# Altium schematic sheet 0_overview.SchDoc
size A; SheetNumber: 1; SheetTotal: 5
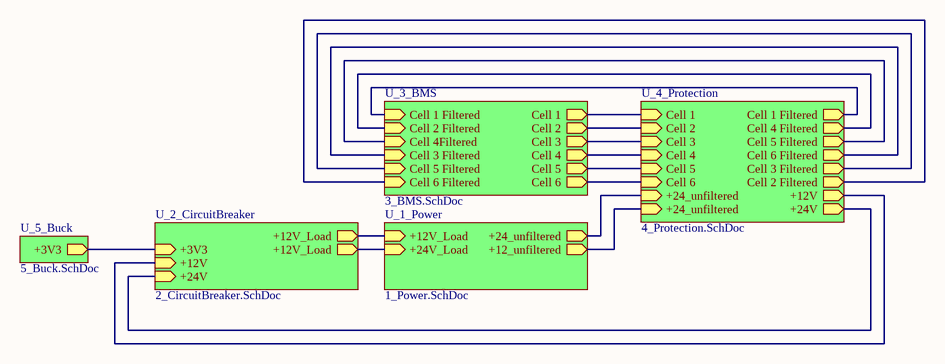
[diagram p0: 0_overview.SchDoc]

## Sub-sheets
U_1_Power = 1_Power.SchDoc: +12V_Load (in), +24V_Load (in), +24_unfiltered (out), +12_unfiltered (out)
U_2_CircuitBreaker = 2_CircuitBreaker.SchDoc: +12V_Load (out), +12V_Load (out), +12V (in), +24V (in), +3V3 (in)
U_3_BMS = 3_BMS.SchDoc: Cell 1 (out), Cell 2 (out), Cell 3 (out), Cell 4 (out), Cell 5 (out), Cell 6 (out), Cell 1 Filtered (in), Cell 2 Filtered (in), Cell 4Filtered (in), Cell 3 Filtered (in), Cell 5 Filtered (in), Cell 6 Filtered (in)
U_4_Protection = 4_Protection.SchDoc: Cell 1 (in), Cell 2 (in), Cell 3 (in), Cell 4 (in), Cell 5 (in), Cell 6 (in), Cell 1 Filtered (out), Cell 4 Filtered (out), Cell 5 Filtered (out), Cell 6 Filtered (out), Cell 3 Filtered (out), Cell 2 Filtered (out), +12V (out), +24_unfiltered (in), +24V (out), +24_unfiltered (in)
U_5_Buck = 5_Buck.SchDoc: +3V3 (out)

## Nets
(unnamed): sheet U_1_Power/+12V_Load, sheet U_2_CircuitBreaker/+12V_Load
(unnamed): sheet U_1_Power/+24V_Load, sheet U_2_CircuitBreaker/+12V_Load
(unnamed): sheet U_1_Power/+24_unfiltered, sheet U_4_Protection/+24_unfiltered
(unnamed): sheet U_1_Power/+12_unfiltered, sheet U_4_Protection/+24_unfiltered
(unnamed): sheet U_2_CircuitBreaker/+12V, sheet U_4_Protection/+12V
(unnamed): sheet U_2_CircuitBreaker/+24V, sheet U_4_Protection/+24V
(unnamed): sheet U_2_CircuitBreaker/+3V3, sheet U_5_Buck/+3V3
(unnamed): sheet U_4_Protection/Cell 1, sheet U_3_BMS/Cell 1
(unnamed): sheet U_4_Protection/Cell 2, sheet U_3_BMS/Cell 2
(unnamed): sheet U_4_Protection/Cell 3, sheet U_3_BMS/Cell 3
(unnamed): sheet U_4_Protection/Cell 4, sheet U_3_BMS/Cell 4
(unnamed): sheet U_4_Protection/Cell 5, sheet U_3_BMS/Cell 5
(unnamed): sheet U_4_Protection/Cell 6, sheet U_3_BMS/Cell 6
(unnamed): sheet U_4_Protection/Cell 1 Filtered, sheet U_3_BMS/Cell 1 Filtered
(unnamed): sheet U_4_Protection/Cell 4 Filtered, sheet U_3_BMS/Cell 2 Filtered
(unnamed): sheet U_4_Protection/Cell 5 Filtered, sheet U_3_BMS/Cell 4Filtered
(unnamed): sheet U_4_Protection/Cell 6 Filtered, sheet U_3_BMS/Cell 3 Filtered
(unnamed): sheet U_4_Protection/Cell 3 Filtered, sheet U_3_BMS/Cell 5 Filtered
(unnamed): sheet U_4_Protection/Cell 2 Filtered, sheet U_3_BMS/Cell 6 Filtered